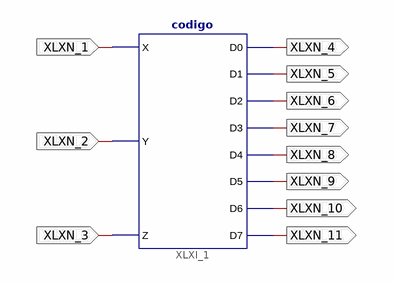
[diagram p0: schematic sheet 1]
// Xilinx ISE schematic esquema.sch (xbr) as structural Verilog: 1 symbols, 11 ports
module esquema (
  input  XLXN_1,
  input  XLXN_2,
  input  XLXN_3,
  output XLXN_4,
  output XLXN_5,
  output XLXN_6,
  output XLXN_7,
  output XLXN_8,
  output XLXN_9,
  output XLXN_10,
  output XLXN_11
);

  codigo XLXI_1 (
    .X(XLXN_1), .Y(XLXN_2), .Z(XLXN_3), .D0(XLXN_4), .D1(XLXN_5), .D2(XLXN_6), .D3(XLXN_7), .D4(XLXN_8),
    .D5(XLXN_9), .D6(XLXN_10), .D7(XLXN_11));
endmodule
